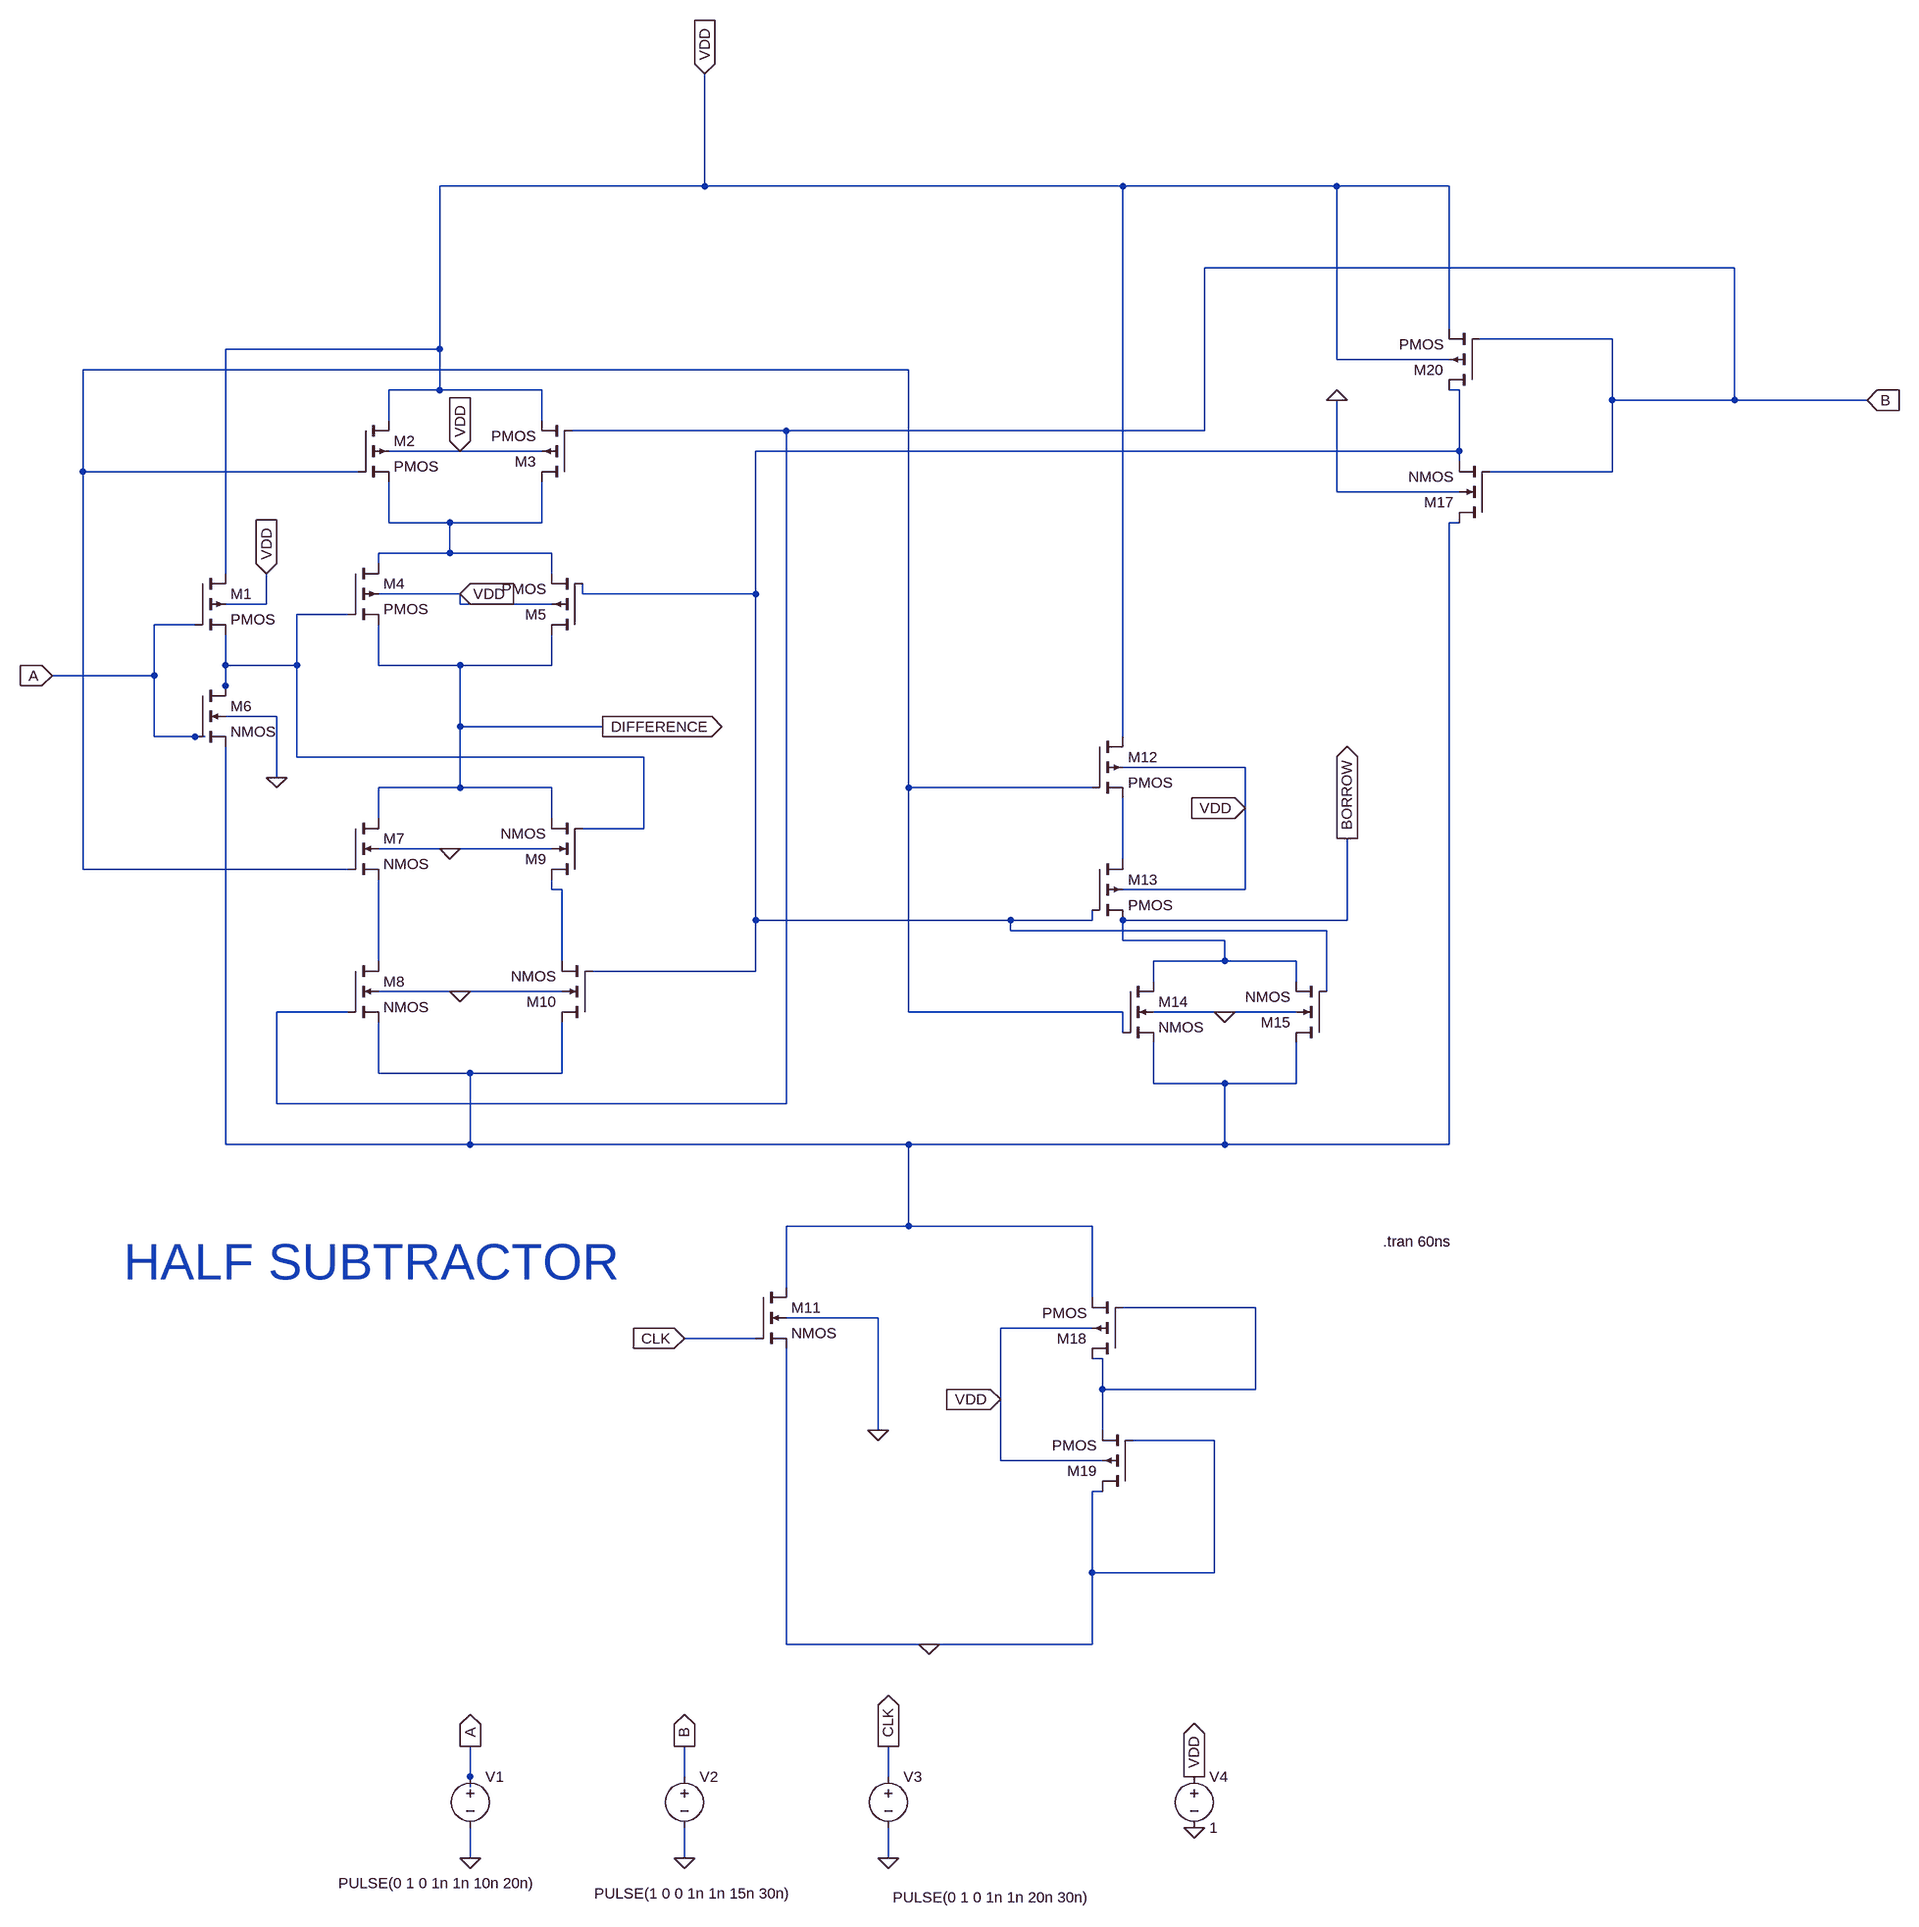
[diagram p0: schematic HALF SUBTRACTOR.asc]
HALF SUBTRACTOR.asc, the LTspice schematic file:
Version 4
SHEET 1 3020 2076
WIRE 1136 -624 1136 -800
WIRE 1136 -624 720 -624
WIRE 1792 -624 1136 -624
WIRE 2128 -624 1792 -624
WIRE 2304 -624 2128 -624
WIRE 2752 -496 1920 -496
WIRE 2304 -400 2304 -624
WIRE 2560 -384 2352 -384
WIRE 720 -368 720 -624
WIRE 720 -368 384 -368
WIRE 2128 -352 2128 -624
WIRE 2304 -352 2128 -352
WIRE 1456 -336 160 -336
WIRE 720 -304 720 -368
WIRE 720 -304 640 -304
WIRE 880 -304 720 -304
WIRE 2320 -304 2304 -304
WIRE 2560 -288 2560 -384
WIRE 2752 -288 2752 -496
WIRE 2752 -288 2560 -288
WIRE 2960 -288 2752 -288
WIRE 640 -256 640 -304
WIRE 880 -256 880 -304
WIRE 1264 -240 928 -240
WIRE 1920 -240 1920 -496
WIRE 1920 -240 1264 -240
WIRE 752 -208 640 -208
WIRE 880 -208 752 -208
WIRE 2320 -208 2320 -304
WIRE 2320 -208 1216 -208
WIRE 2320 -192 2320 -208
WIRE 160 -176 160 -336
WIRE 592 -176 160 -176
WIRE 2560 -176 2560 -288
WIRE 2560 -176 2368 -176
WIRE 2128 -144 2128 -288
WIRE 2320 -144 2128 -144
WIRE 640 -96 640 -160
WIRE 736 -96 640 -96
WIRE 880 -96 880 -160
WIRE 880 -96 736 -96
WIRE 2320 -96 2304 -96
WIRE 736 -48 736 -96
WIRE 736 -48 624 -48
WIRE 896 -48 736 -48
WIRE 624 -32 624 -48
WIRE 384 -16 384 -368
WIRE 896 -16 896 -48
WIRE 752 16 624 16
WIRE 944 16 944 0
WIRE 1216 16 1216 -208
WIRE 1216 16 944 16
WIRE 448 32 448 -16
WIRE 448 32 384 32
WIRE 752 32 752 16
WIRE 896 32 752 32
WIRE 576 48 496 48
WIRE 336 64 272 64
WIRE 384 128 384 80
WIRE 496 128 496 48
WIRE 496 128 384 128
WIRE 624 128 624 64
WIRE 752 128 624 128
WIRE 896 128 896 80
WIRE 896 128 752 128
WIRE 272 144 272 64
WIRE 272 144 112 144
WIRE 384 160 384 128
WIRE 384 176 384 160
WIRE 464 208 384 208
WIRE 752 224 752 128
WIRE 976 224 752 224
WIRE 272 240 272 144
WIRE 336 240 272 240
WIRE 352 240 336 240
WIRE 1792 240 1792 -624
WIRE 496 272 496 128
WIRE 1040 272 496 272
WIRE 1984 288 1792 288
WIRE 464 304 464 208
WIRE 752 320 752 224
WIRE 752 320 624 320
WIRE 896 320 752 320
WIRE 1456 320 1456 -336
WIRE 1744 320 1456 320
WIRE 1984 352 1984 288
WIRE 624 368 624 320
WIRE 896 368 896 320
WIRE 1040 384 1040 272
WIRE 1040 384 944 384
WIRE 736 416 624 416
WIRE 896 416 736 416
WIRE 1792 432 1792 336
WIRE 160 448 160 -176
WIRE 576 448 160 448
WIRE 896 480 896 464
WIRE 912 480 896 480
WIRE 1984 480 1984 352
WIRE 1984 480 1792 480
WIRE 1216 528 1216 16
WIRE 1616 528 1216 528
WIRE 1744 528 1744 512
WIRE 1744 528 1616 528
WIRE 2144 528 2144 400
WIRE 2144 528 1792 528
WIRE 1616 544 1616 528
WIRE 2112 544 1616 544
WIRE 1792 560 1792 528
WIRE 1952 560 1792 560
WIRE 624 592 624 464
WIRE 912 592 912 480
WIRE 1952 592 1952 560
WIRE 1952 592 1840 592
WIRE 2064 592 1952 592
WIRE 1216 608 1216 528
WIRE 1216 608 960 608
WIRE 1840 624 1840 592
WIRE 2064 624 2064 592
WIRE 752 640 624 640
WIRE 912 640 752 640
WIRE 2112 640 2112 544
WIRE 576 672 464 672
WIRE 1456 672 1456 320
WIRE 1792 672 1456 672
WIRE 1952 672 1840 672
WIRE 2064 672 1952 672
WIRE 1792 704 1792 672
WIRE 624 768 624 688
WIRE 768 768 624 768
WIRE 912 768 912 688
WIRE 912 768 768 768
WIRE 1840 784 1840 720
WIRE 1952 784 1840 784
WIRE 2064 784 2064 720
WIRE 2064 784 1952 784
WIRE 464 816 464 672
WIRE 1264 816 1264 -240
WIRE 1264 816 464 816
WIRE 384 880 384 256
WIRE 768 880 768 768
WIRE 768 880 384 880
WIRE 1456 880 768 880
WIRE 1952 880 1952 784
WIRE 1952 880 1456 880
WIRE 2304 880 2304 -96
WIRE 2304 880 1952 880
WIRE 1456 1008 1456 880
WIRE 1456 1008 1264 1008
WIRE 1744 1008 1456 1008
WIRE 1264 1104 1264 1008
WIRE 1744 1120 1744 1008
WIRE 2000 1136 1792 1136
WIRE 1408 1152 1264 1152
WIRE 1744 1168 1600 1168
WIRE 1216 1184 1104 1184
WIRE 1760 1216 1744 1216
WIRE 1760 1264 1760 1216
WIRE 2000 1264 2000 1136
WIRE 2000 1264 1760 1264
WIRE 1600 1280 1600 1168
WIRE 1408 1328 1408 1152
WIRE 1760 1328 1760 1264
WIRE 1936 1344 1808 1344
WIRE 1600 1376 1600 1280
WIRE 1760 1376 1600 1376
WIRE 1760 1424 1744 1424
WIRE 1744 1552 1744 1424
WIRE 1936 1552 1936 1344
WIRE 1936 1552 1744 1552
WIRE 1264 1664 1264 1200
WIRE 1488 1664 1264 1664
WIRE 1744 1664 1744 1552
WIRE 1744 1664 1488 1664
WIRE 768 1872 768 1824
WIRE 1104 1872 1104 1824
WIRE 1424 1872 1424 1824
WIRE 768 1888 768 1872
WIRE 768 2000 768 1952
WIRE 1104 2000 1104 1952
WIRE 1424 2000 1424 1952
FLAG 752 640 0
FLAG 736 416 0
FLAG 1136 -800 VDD
IOPIN 1136 -800 In
FLAG 112 144 A
IOPIN 112 144 In
FLAG 752 -208 VDD
IOPIN 752 -208 In
FLAG 752 16 VDD
IOPIN 752 16 In
FLAG 464 304 0
FLAG 448 -16 VDD
IOPIN 448 -16 In
FLAG 1984 352 VDD
IOPIN 1984 352 In
FLAG 1488 1664 0
FLAG 1600 1280 VDD
IOPIN 1600 1280 In
FLAG 2960 -288 B
IOPIN 2960 -288 In
FLAG 1952 672 0
FLAG 1408 1328 0
FLAG 976 224 DIFFERENCE
IOPIN 976 224 Out
FLAG 2144 400 BORROW
IOPIN 2144 400 Out
FLAG 1104 1184 CLK
IOPIN 1104 1184 In
FLAG 768 1824 A
IOPIN 768 1824 Out
FLAG 768 2000 0
FLAG 1104 2000 0
FLAG 1424 2000 0
FLAG 1104 1824 B
IOPIN 1104 1824 Out
FLAG 1424 1824 CLK
IOPIN 1424 1824 Out
FLAG 1904 1872 VDD
IOPIN 1904 1872 Out
FLAG 1904 1952 0
FLAG 2128 -288 0
SYMBOL pmos4 336 -16 R0
SYMATTR InstName M1
SYMBOL pmos4 592 -256 R0
SYMATTR InstName M2
SYMBOL pmos4 928 -160 R180
SYMATTR InstName M3
SYMBOL pmos4 576 -32 R0
SYMATTR InstName M4
SYMBOL pmos4 944 80 R180
SYMATTR InstName M5
SYMBOL nmos4 336 160 R0
SYMATTR InstName M6
SYMBOL nmos4 576 368 R0
SYMATTR InstName M7
SYMBOL nmos4 576 592 R0
SYMATTR InstName M8
SYMBOL nmos4 944 464 R180
SYMATTR InstName M9
SYMBOL nmos4 960 688 R180
SYMATTR InstName M10
SYMBOL nmos4 1216 1104 R0
SYMATTR InstName M11
SYMBOL pmos4 1744 240 R0
SYMATTR InstName M12
SYMBOL pmos4 1744 432 R0
SYMATTR InstName M13
SYMBOL nmos4 1792 624 R0
SYMATTR InstName M14
SYMBOL nmos4 2112 720 R180
SYMATTR InstName M15
SYMBOL nmos4 2368 -96 R180
SYMATTR InstName M17
SYMBOL pmos4 1792 1216 R180
SYMATTR InstName M18
SYMBOL pmos4 1808 1424 R180
SYMATTR InstName M19
SYMBOL voltage 768 1856 R0
WINDOW 3 -207 183 Left 2
SYMATTR Value PULSE(0 1 0 1n 1n 10n 20n)
SYMATTR InstName V1
SYMBOL voltage 1104 1856 R0
WINDOW 3 -141 199 Left 2
SYMATTR Value PULSE(1 0 0 1n 1n 15n 30n)
SYMATTR InstName V2
SYMBOL voltage 1424 1856 R0
WINDOW 3 7 205 Left 2
SYMATTR Value PULSE(0 1 0 1n 1n 20n 30n)
SYMATTR InstName V3
SYMBOL voltage 1904 1856 R0
SYMATTR InstName V4
SYMATTR Value 1
SYMBOL pmos4 2352 -304 R180
SYMATTR InstName M20
TEXT 2200 1032 Left 2 !.tran 60ns
TEXT 224 1064 Left 6 ;HALF SUBTRACTOR

The netlist it stands for:
* HALF SUBTRACTOR.asc
M1 VDD A N005 VDD PMOS
M2 VDD N001 N003 VDD PMOS
M3 N003 B VDD VDD PMOS
M4 N003 N005 DIFFERENCE VDD PMOS
M5 DIFFERENCE N002 N003 VDD PMOS
M6 N005 A N004 0 NMOS
M7 DIFFERENCE N001 N008 0 NMOS
M8 N008 B N004 0 NMOS
M9 N007 N005 DIFFERENCE 0 NMOS
M10 N004 N002 N007 0 NMOS
M11 N004 CLK 0 0 NMOS
M12 VDD N001 N006 VDD PMOS
M13 N006 N002 BORROW VDD PMOS
M14 BORROW N001 N004 0 NMOS
M15 N004 N002 BORROW 0 NMOS
M17 N004 B N002 0 NMOS
M18 N009 N009 N004 VDD PMOS
M19 0 0 N009 VDD PMOS
V1 A 0 PULSE(0 1 0 1n 1n 10n 20n)
V2 B 0 PULSE(1 0 0 1n 1n 15n 30n)
V3 CLK 0 PULSE(0 1 0 1n 1n 20n 30n)
V4 VDD 0 1
M20 N002 B VDD VDD PMOS
.model NMOS NMOS
.model PMOS PMOS
.lib standard.mos
.tran 60ns
* HALF SUBTRACTOR
.backanno
.end